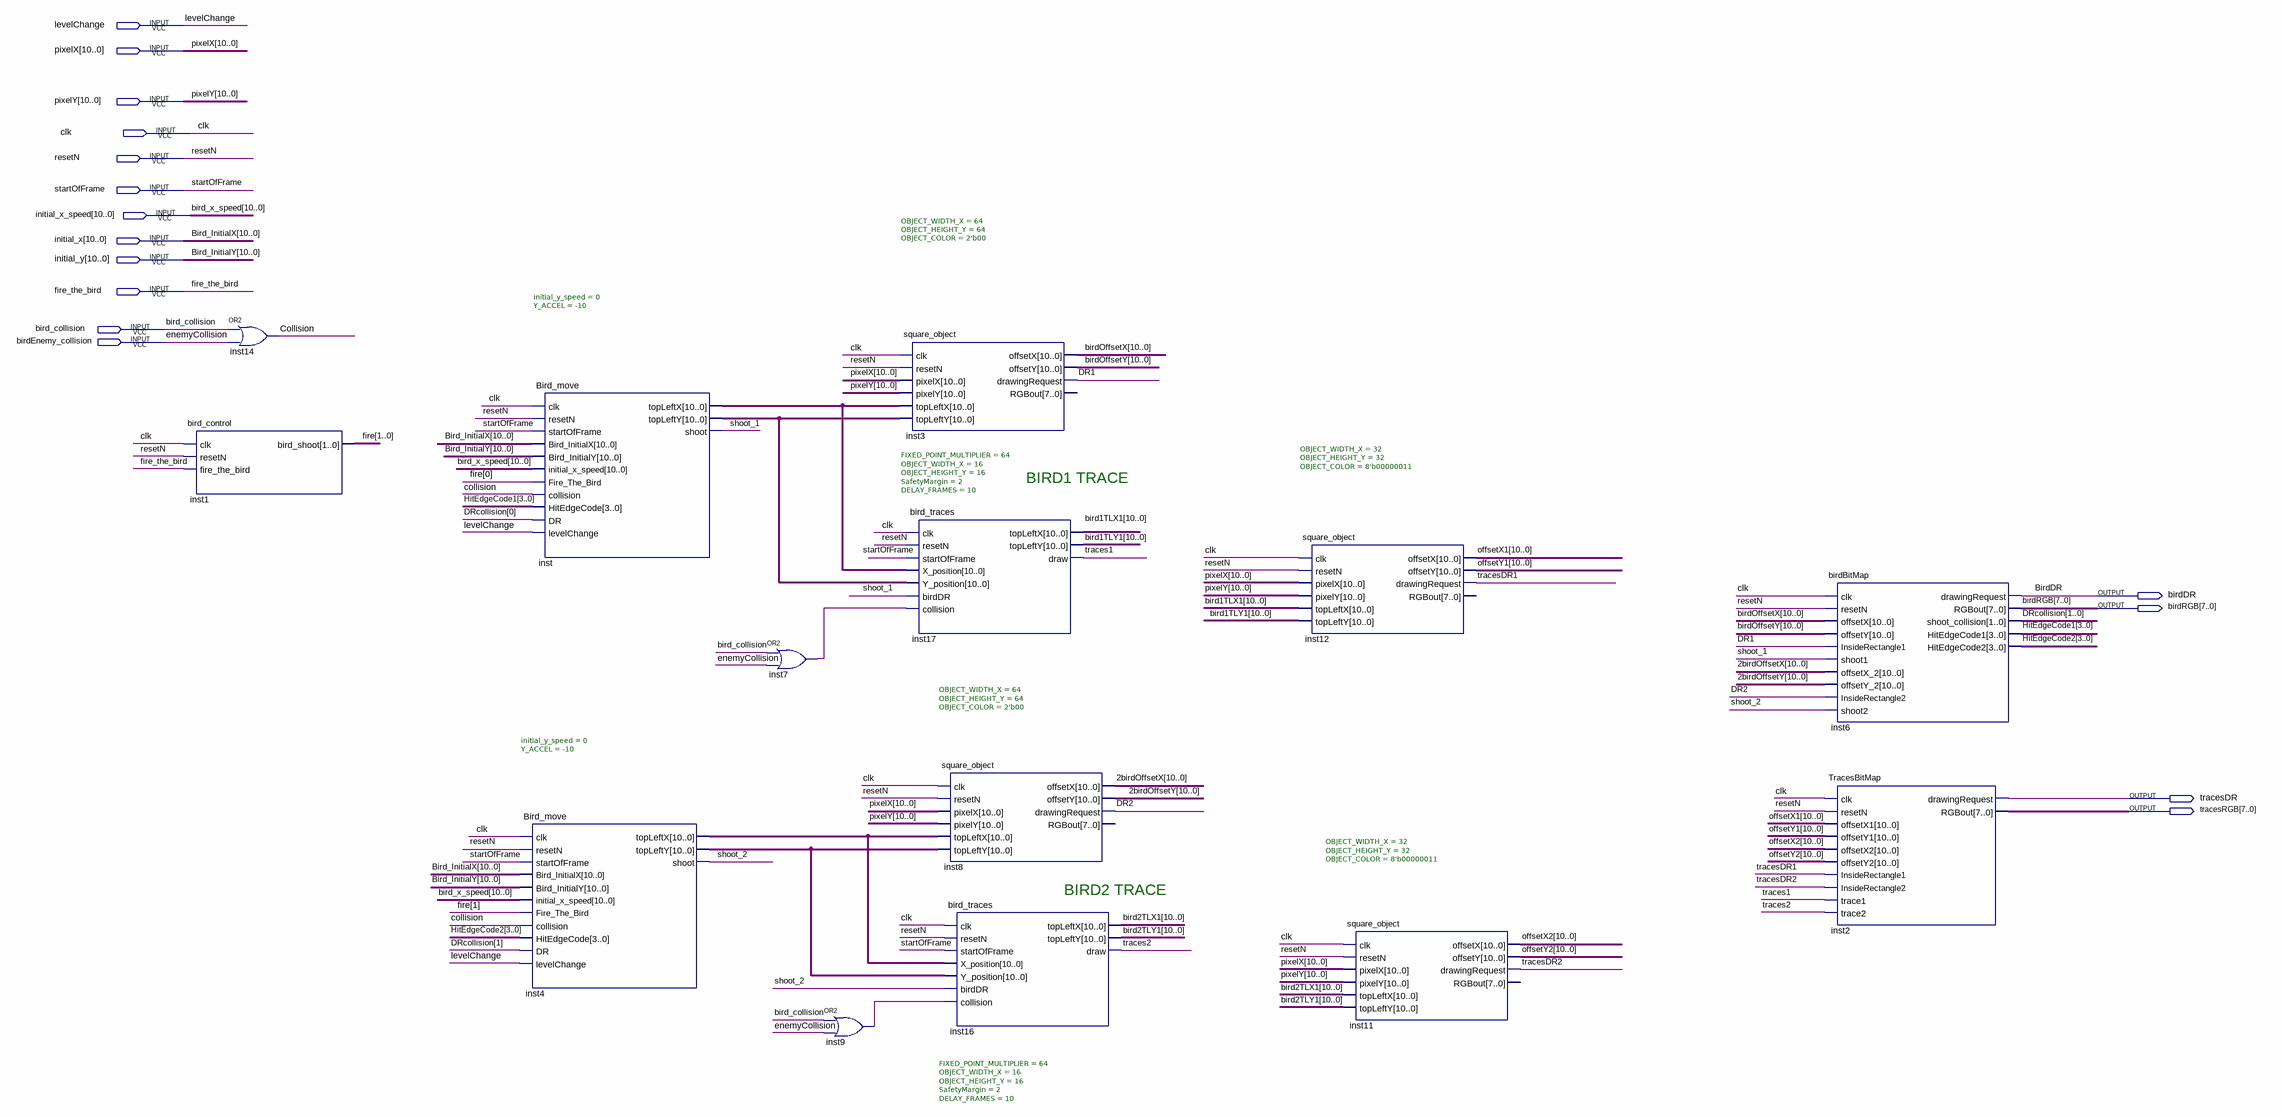
[diagram p0: schematic sheet]
// Quartus schematic Bird_Block_T.bdf as structural Verilog: 14 symbols, 16 pins
module Bird_Block_T (
  input  levelChange,
  input  [10:0] pixelX,
  input  [10:0] pixelY,
  input  clk,
  input  resetN,
  input  startOfFrame,
  input  [10:0] initial_x_speed,
  input  [10:0] initial_x,
  input  [10:0] initial_y,
  input  fire_the_bird,
  input  bird_collision,
  input  birdEnemy_collision,
  output birdDR,
  output [7:0] birdRGB,
  output tracesDR,
  output [7:0] tracesRGB
);

  wire collision, DR1, DR2, inst7_out, inst9_out, shoot_1, shoot_2, traces1, traces2, tracesDR1, tracesDR2;
  wire [1:0] DRcollision, fire;
  wire [3:0] HitEdgeCode1, HitEdgeCode2;
  wire [10:0] \2birdOffsetX , \2birdOffsetY , bird1TLX1, bird1TLY1, bird2TLX1, bird2TLY1, birdOffsetX,
       birdOffsetY, inst4_topleftx, inst4_toplefty, inst_topleftx, inst_toplefty, offsetX1, offsetX2,
       offsetY1, offsetY2;

  bird_control inst1 (.clk(clk), .resetN(resetN), .fire_the_bird(fire_the_bird), .bird_shoot(fire));
  or inst14 (collision, bird_collision, birdEnemy_collision);
  Bird_move #(.initial_y_speed(0), .Y_ACCEL(-10)) inst (
    .clk(clk), .resetN(resetN), .startOfFrame(startOfFrame), .Bird_InitialX(initial_x),
    .Bird_InitialY(initial_y), .initial_x_speed(initial_x_speed), .Fire_The_Bird(fire[0]),
    .collision(collision), .HitEdgeCode(HitEdgeCode1), .DR(DRcollision[0]), .levelChange(levelChange),
    .topLeftX(inst_topleftx), .topLeftY(inst_toplefty), .shoot(shoot_1));
  Bird_move #(.initial_y_speed(0), .Y_ACCEL(-10)) inst4 (
    .clk(clk), .resetN(resetN), .startOfFrame(startOfFrame), .Bird_InitialX(initial_x),
    .Bird_InitialY(initial_y), .initial_x_speed(initial_x_speed), .Fire_The_Bird(fire[1]),
    .collision(collision), .HitEdgeCode(HitEdgeCode2), .DR(DRcollision[1]), .levelChange(levelChange),
    .topLeftX(inst4_topleftx), .topLeftY(inst4_toplefty), .shoot(shoot_2));
  or inst7 (inst7_out, bird_collision, birdEnemy_collision);
  or inst9 (inst9_out, bird_collision, birdEnemy_collision);
  square_object #(.OBJECT_WIDTH_X(64), .OBJECT_HEIGHT_Y(64), .OBJECT_COLOR(2'b00)) inst3 (
    .clk(clk), .resetN(resetN), .pixelX(pixelX), .pixelY(pixelY), .topLeftX(inst_topleftx),
    .topLeftY(inst_toplefty), .offsetX(birdOffsetX), .offsetY(birdOffsetY), .drawingRequest(DR1));  // open: RGBout
  bird_traces #(.FIXED_POINT_MULTIPLIER(64), .OBJECT_WIDTH_X(16), .OBJECT_HEIGHT_Y(16), .SafetyMargin(2), .DELAY_FRAMES(10)) inst17 (
    .clk(clk), .resetN(resetN), .startOfFrame(startOfFrame), .X_position(inst_topleftx),
    .Y_position(inst_toplefty), .birdDR(shoot_1), .collision(inst7_out), .topLeftX(bird1TLX1),
    .topLeftY(bird1TLY1), .draw(traces1));
  square_object #(.OBJECT_WIDTH_X(64), .OBJECT_HEIGHT_Y(64), .OBJECT_COLOR(2'b00)) inst8 (
    .clk(clk), .resetN(resetN), .pixelX(pixelX), .pixelY(pixelY), .topLeftX(inst4_topleftx),
    .topLeftY(inst4_toplefty), .offsetX(\2birdOffsetX ), .offsetY(\2birdOffsetY ), .drawingRequest(DR2));  // open: RGBout
  bird_traces #(.FIXED_POINT_MULTIPLIER(64), .OBJECT_WIDTH_X(16), .OBJECT_HEIGHT_Y(16), .SafetyMargin(2), .DELAY_FRAMES(10)) inst16 (
    .clk(clk), .resetN(resetN), .startOfFrame(startOfFrame), .X_position(inst4_topleftx),
    .Y_position(inst4_toplefty), .birdDR(shoot_2), .collision(inst9_out), .topLeftX(bird2TLX1),
    .topLeftY(bird2TLY1), .draw(traces2));
  square_object #(.OBJECT_WIDTH_X(32), .OBJECT_HEIGHT_Y(32), .OBJECT_COLOR(8'b00000011)) inst12 (
    .clk(clk), .resetN(resetN), .pixelX(pixelX), .pixelY(pixelY), .topLeftX(bird1TLX1), .topLeftY(bird1TLY1),
    .offsetX(offsetX1), .offsetY(offsetY1), .drawingRequest(tracesDR1));  // open: RGBout
  square_object #(.OBJECT_WIDTH_X(32), .OBJECT_HEIGHT_Y(32), .OBJECT_COLOR(8'b00000011)) inst11 (
    .clk(clk), .resetN(resetN), .pixelX(pixelX), .pixelY(pixelY), .topLeftX(bird2TLX1), .topLeftY(bird2TLY1),
    .offsetX(offsetX2), .offsetY(offsetY2), .drawingRequest(tracesDR2));  // open: RGBout
  birdBitMap inst6 (
    .clk(clk), .resetN(resetN), .offsetX(birdOffsetX), .offsetY(birdOffsetY), .InsideRectangle1(DR1),
    .shoot1(shoot_1), .offsetX_2(\2birdOffsetX ), .offsetY_2(\2birdOffsetY ), .InsideRectangle2(DR2),
    .shoot2(shoot_2), .drawingRequest(birdDR), .RGBout(birdRGB), .shoot_collision(DRcollision),
    .HitEdgeCode1(HitEdgeCode1), .HitEdgeCode2(HitEdgeCode2));
  TracesBitMap inst2 (
    .clk(clk), .resetN(resetN), .offsetX1(offsetX1), .offsetY1(offsetY1), .offsetX2(offsetX2),
    .offsetY2(offsetY2), .InsideRectangle1(tracesDR1), .InsideRectangle2(tracesDR2), .trace1(traces1),
    .trace2(traces2), .drawingRequest(tracesDR), .RGBout(tracesRGB));

  // Other names for the same wires on the sheet: Bird_InitialX[10:0] = initial_x; Bird_InitialY[10:0] = initial_y;
  //   bird_x_speed[10:0] = initial_x_speed; enemyCollision = birdEnemy_collision

  // Notes on the sheet:
  //   BIRD1 TRACE
  //   BIRD2 TRACE
endmodule
